# EAGLE schematic a-tiny-tractor (EAGLE 8.3.2)
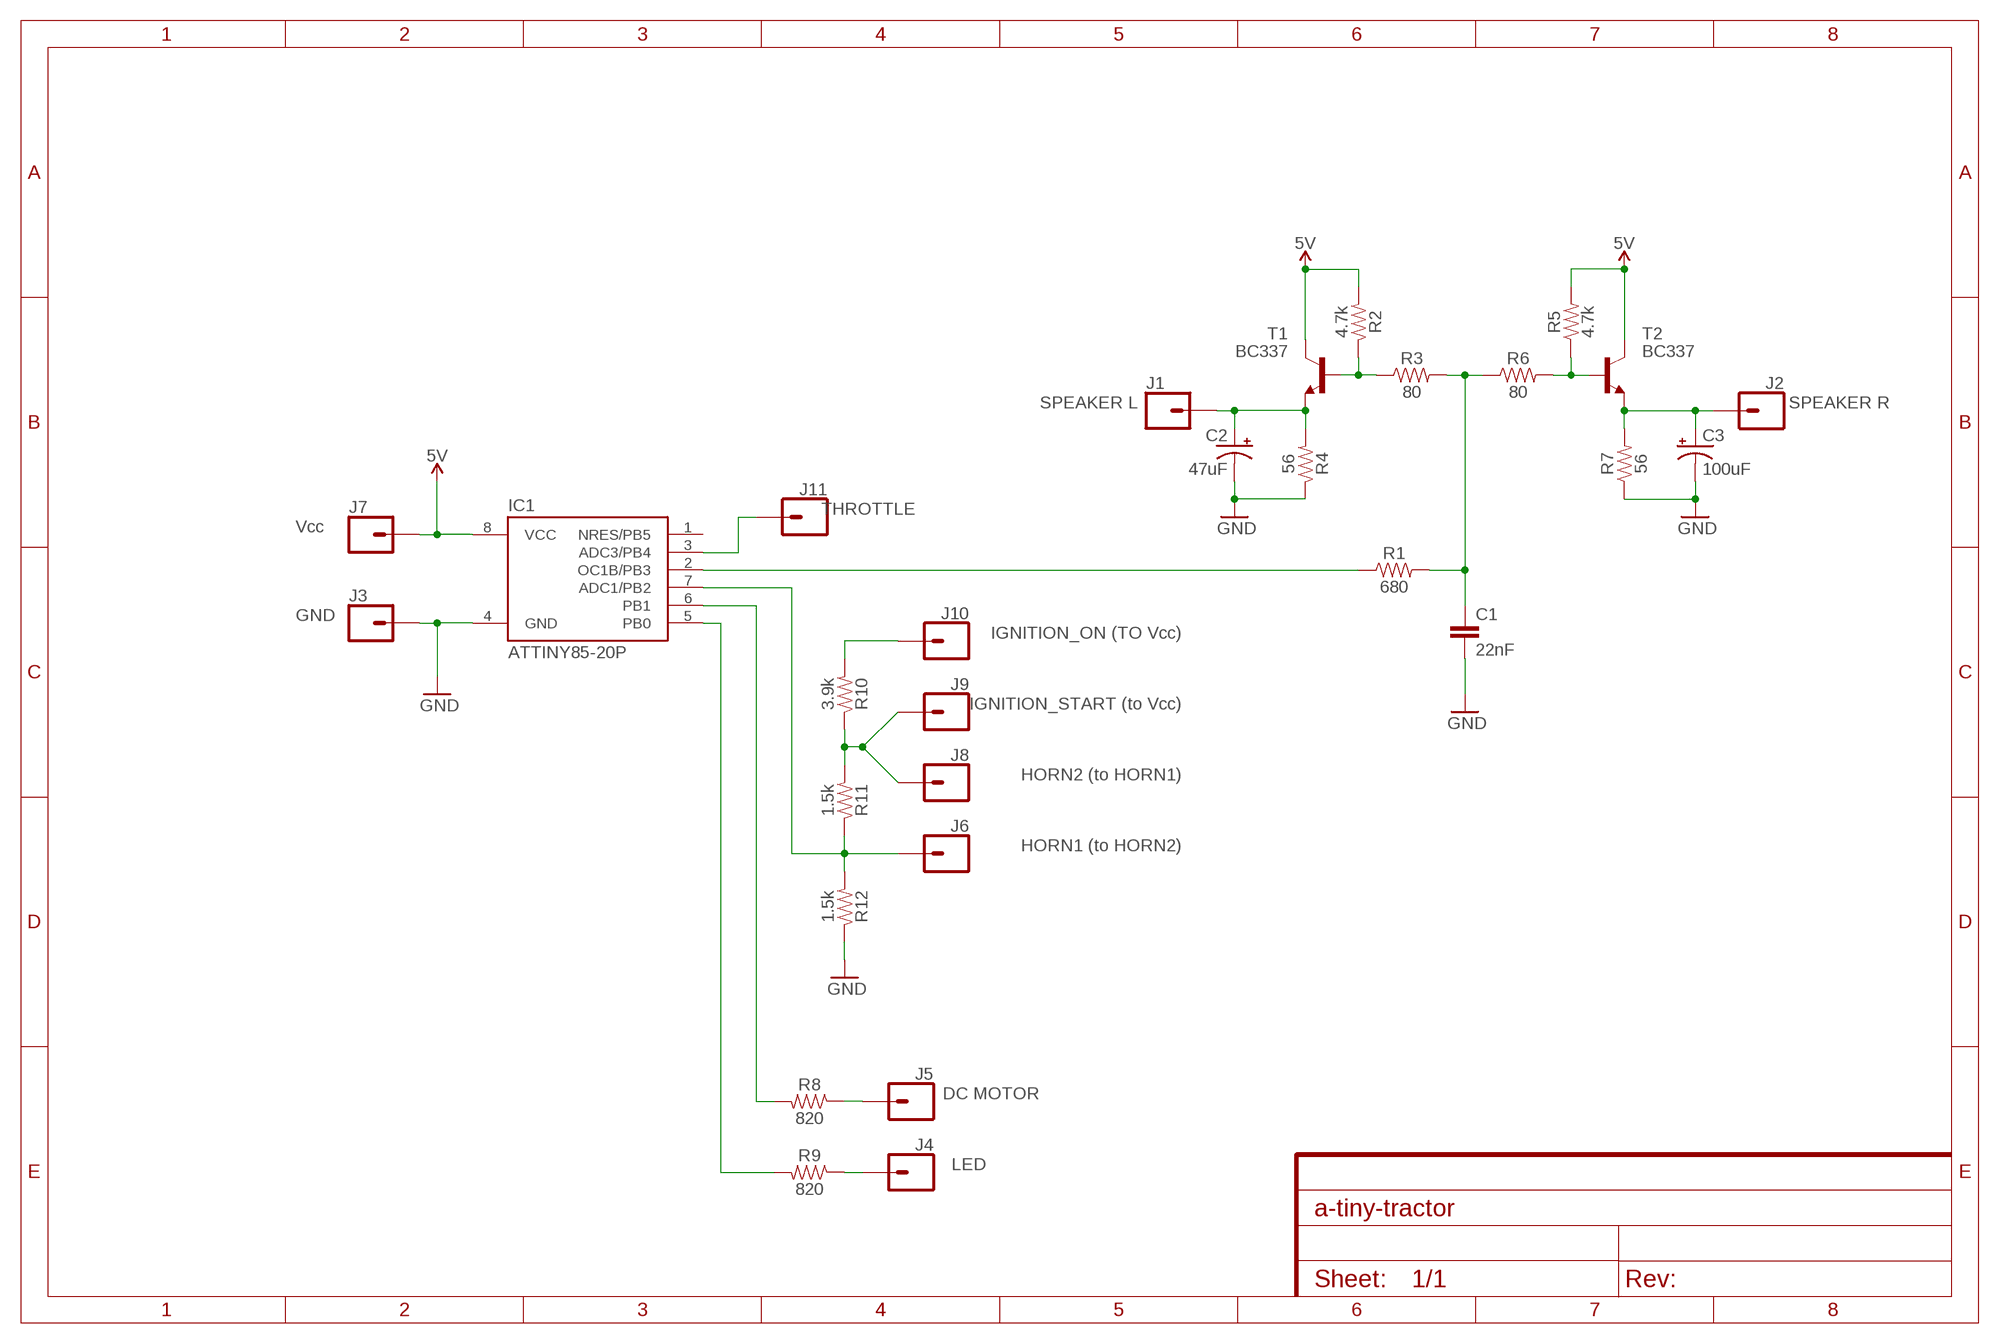
[diagram p0: schematic, sheet 1]
FRAME1 (FRAME-A4L): CNAME: Main Board; CREVISION: 1.0; DESIGNER: William Spinelli

## Parts
C1  22nF  10NF-PTH-10MM-10000V-1-%  [CAP-PTH-10MM]
C2  47uF  10UF-POLAR-RADIAL-2.5MM-25V-20%  [CPOL-RADIAL-2.5MM-5MM]
C3  100uF  10UF-POLAR-RADIAL-2.5MM-25V-20%  [CPOL-RADIAL-2.5MM-5MM]
IC1  ATTINY85-20P  [PDIP08_300MIL]
J1  SPEAKER L  CONN_01  [1X01]
J2  SPEAKER R  CONN_01  [1X01]
J3  GND  CONN_01  [1X01]
J4  LED  CONN_01  [1X01]
J5  DC MOTOR  CONN_01  [1X01]
J6  HORN1 (to HORN2)  CONN_01  [1X01]
J7  Vcc  CONN_01  [1X01]
J8  HORN2 (to HORN1)  CONN_01  [1X01]
J9  IGNITION_START (to Vcc)  CONN_01  [1X01]
J10  IGNITION_ON (TO Vcc)  CONN_01  [1X01]
J11  THROTTLE  CONN_01  [1X01]
R1  680  1KOHM-HORIZ-1/4W-5%  [AXIAL-0.3]
R2  4.7k  1KOHM-HORIZ-1/4W-5%  [AXIAL-0.3]
R3  80  1KOHM-HORIZ-1/4W-5%  [AXIAL-0.3]
R4  56  1KOHM-HORIZ-1/4W-5%  [AXIAL-0.3]
R5  4.7k  1KOHM-HORIZ-1/4W-5%  [AXIAL-0.3]
R6  80  1KOHM-HORIZ-1/4W-5%  [AXIAL-0.3]
R7  56  1KOHM-HORIZ-1/4W-5%  [AXIAL-0.3]
R8  820  1KOHM-HORIZ-1/4W-5%  [AXIAL-0.3]
R9  820  1KOHM-HORIZ-1/4W-5%  [AXIAL-0.3]
R10  3.9k  1KOHM-HORIZ-1/4W-5%  [AXIAL-0.3]
R11  1.5k  1KOHM-HORIZ-1/4W-5%  [AXIAL-0.3]
R12  1.5k  1KOHM-HORIZ-1/4W-5%  [AXIAL-0.3]
T1  BC337  [TO92]
T2  BC337  [TO92]

## Nets
5V: IC1.8(VCC) J7.1 R2.P$2 R5.P$2 T1.3(C) T2.3(C)
GND: C1.2 C2.2(-) C3.2(-) IC1.4(GND) J3.1 R4.P$1 R7.P$1 R12.P$1
N$1: IC1.6(PB1) R8.P$2
N$2: C2.1(+) J1.1 R4.P$2 T1.1(E)
N$3: IC1.2(OC1B/PB3) R1.P$1
N$4: R2.P$1 R3.P$1 T1.2(B)
N$5: R5.P$1 R6.P$2 T2.2(B)
N$6: C3.1(+) J2.1 R7.P$2 T2.1(E)
N$7: C1.1 R1.P$2 R3.P$2 R6.P$1
N$8: IC1.5(PB0) R9.P$2
N$9: J4.1 R9.P$1
N$10: J5.1 R8.P$1
N$11: IC1.3(ADC3/PB4) J11.1
N$12: IC1.7(ADC1/PB2) J6.1 R11.P$1 R12.P$2
N$13: J8.1 J9.1 R10.P$1 R11.P$2
N$14: J10.1 R10.P$2
Unconnected: IC1.1(NRES/PB5)

## Library data of the parts
C1 = SparkFun-Capacitors:10NF: 0.01uF/10nF/10,000pF ceramic capacitors A capacitor is a passive two-terminal electrical component used to store electrical energy temporarily in an electric field. CAP-09321; PROD_ID: CAP-09321; VALUE: 10nF
C2 C3 = SparkFun-Capacitors:10UF-POLAR: 10.0µF polarized capacitors A capacitor is a passive two-terminal electrical component used to store electrical energy temporarily in an electric field.; PROD_ID: CAP-08440; VALUE: 10uF
IC1 = _hhn_attiny25_45_85:ATTINY85*: ATMEL ATtiny 85 Packages: P = PDIP 08 30mil S = SOIC 08 EIAJ 208mil Technologies Note: for complete ordering code (temp. range, finish, tape&reel etc.) see www.atmel.com • Supply Voltage: V = (1.8…5.5)V | [blank] = (2.7…5.5)V • Speed: 10 = 10 MHz | 20 = 20 MHz Author: Dipl.-Ing. FH Rainer Bayer HHN Hochschule Heilbronn (Heilbronn University), rainer.bayer@hs-heilbronn.de Ingenieurbüro ing-rb, mail@ing-rb.de
J1-J11 = SparkFun-Connectors:CONN_01: Single connection point. Often used as Generic Header-pin footprint for 0.1 inch spaced/style header connections On any of the 0.1 inch spaced packages, you can populate with these: Break Away Headers - Straight <https://www.sparkfun.com/products/116> (PRT-00116) Break Away Male Headers - Right Angle <https://www.sparkfun.com/products/553> (PRT-00553) Female Headers <https://www.sparkfun.com/products/115> (PRT-00115) Break Away Headers - Machine Pin <https://www.sparkfun.com/products/117> (PRT-00117) Break Away Female Headers - Swiss Machine Pin <https://www.sparkfun.com/products/743> (PRT-00743) This device is also useful as a general connection point to wire up your design to another part of your project. Our various solder wires solder well into these plated through hole pads. Hook-Up Wire - Assortment (Stranded, 22 AWG) <https://www.sparkfun.com/products/11375> (PRT-11375) Hook-Up Wire - Assortment (Solid Core, 22 AWG) <https://www.sparkfun.com/products/11367> (PRT-11367) View the entire wire category on our website here <https://www.sparkfun.com/categories/141> Special notes: SMTSO-256-ET is a "flush mount" nut for a 4-40 screw. We mostly use this on specialty testbeds; it is a nice way to connect hardware to your PCB at an adjustable hieght. Also note, the SNAP packages are for using a snappable style connector. We sell a baggie of snaps and they are also used on two LilyPad designs: Snap Assortment - 30 pack (male and female) <https://www.sparkfun.com/products/11347> (DEV-11347) LilyPad Arduino SimpleSnap <https://www.sparkfun.com/products/10941> (DEV-10941) LilyPad SimpleSnap Protoboard <https://www.sparkfun.com/products/10940> (DEV-10940)
R1-R12 = SparkFun-Resistors:1KOHM: 1kΩ resistor A resistor is a passive two-terminal electrical component that implements electrical resistance as a circuit element. Resistors act to reduce current flow, and, at the same time, act to lower voltage levels within circuits. - Wikipedia; PROD_ID: RES-08380; VALUE: 1k
T1 T2 = transistor:BC337: NPN TRANSISTOR